# EAGLE design femto-tia-mainboard (EAGLE 9.2.2)
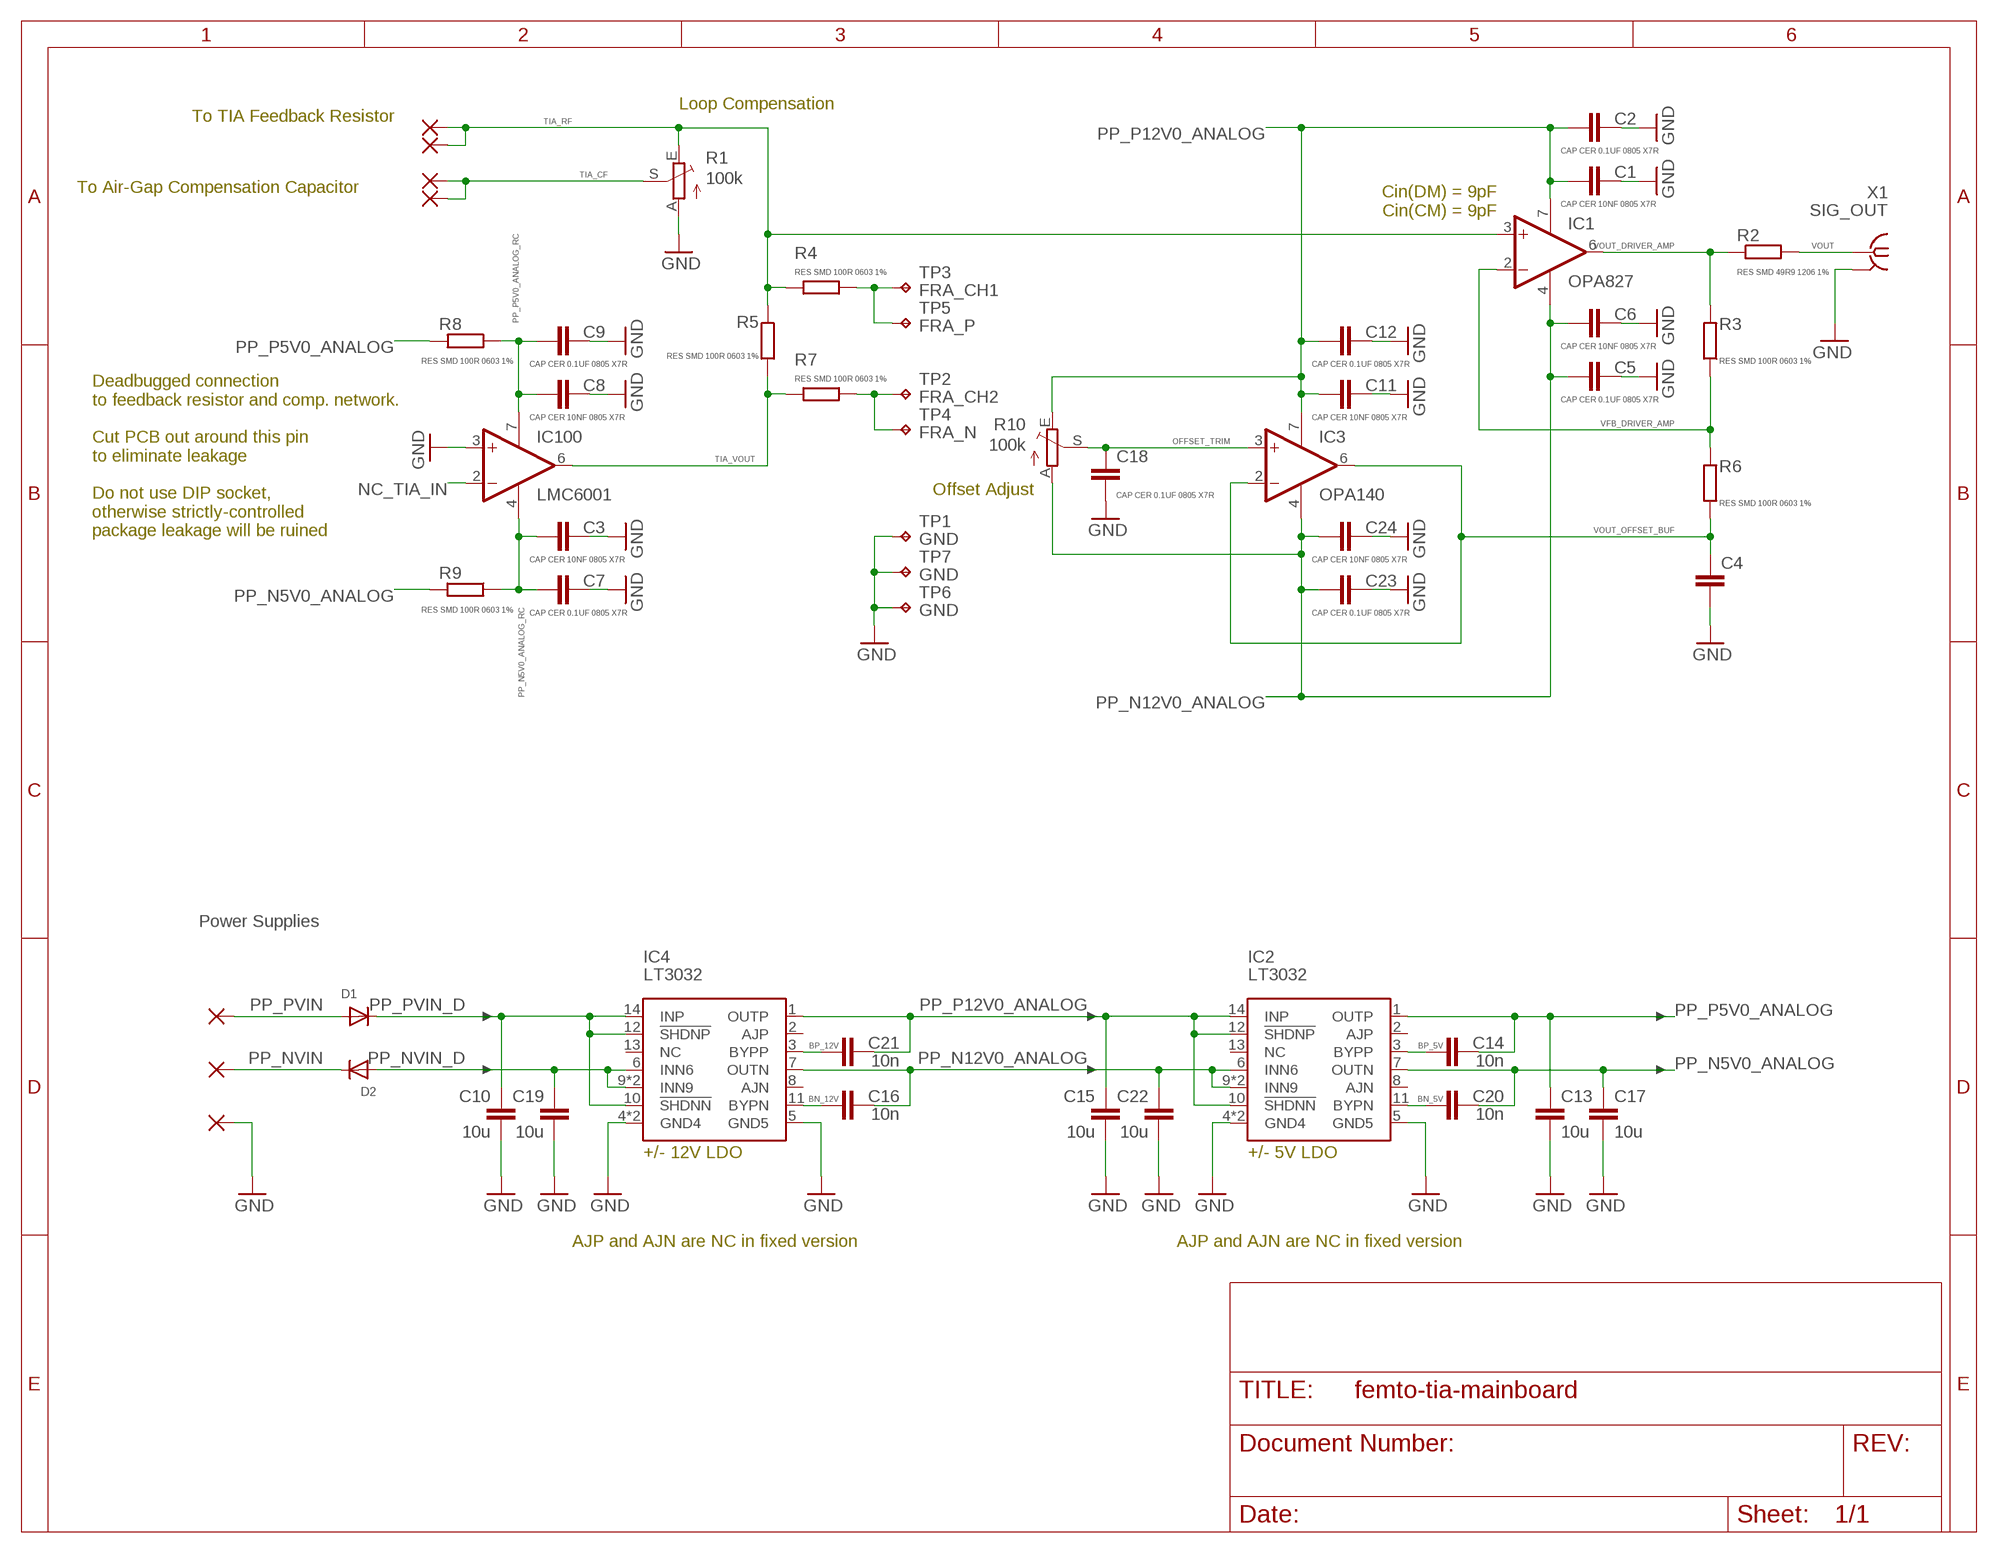
[diagram p0: schematic, sheet 1]

## Parts
C1  CAP CER 10NF 0805 X7R  C-EUC0805  [C0805]
C2  CAP CER 0.1UF 0805 X7R  C-EUC0805  [C0805]
C3  CAP CER 10NF 0805 X7R  C-EUC0805  [C0805]
C4  C-EUC0805  [C0805]
C5  CAP CER 0.1UF 0805 X7R  C-EUC0805  [C0805]
C6  CAP CER 10NF 0805 X7R  C-EUC0805  [C0805]
C7  CAP CER 0.1UF 0805 X7R  C-EUC0805  [C0805]
C8  CAP CER 10NF 0805 X7R  C-EUC0805  [C0805]
C9  CAP CER 0.1UF 0805 X7R  C-EUC0805  [C0805]
C10  10u  C-EUC1206  [C1206]
C11  CAP CER 10NF 0805 X7R  C-EUC0805  [C0805]
C12  CAP CER 0.1UF 0805 X7R  C-EUC0805  [C0805]
C13  10u  C-EUC1206  [C1206]
C14  10n  C-EUC0603  [C0603]
C15  10u  C-EUC1206  [C1206]
C16  10n  C-EUC0603  [C0603]
C17  10u  C-EUC1206  [C1206]
C18  CAP CER 0.1UF 0805 X7R  C-EUC0805  [C0805]
C19  10u  C-EUC1206  [C1206]
C20  10n  C-EUC0603  [C0603]
C21  10n  C-EUC0603  [C0603]
C22  10u  C-EUC1206  [C1206]
C23  CAP CER 0.1UF 0805 X7R  C-EUC0805  [C0805]
C24  CAP CER 10NF 0805 X7R  C-EUC0805  [C0805]
D1  DIODESMA  [SMADIODE]
D2  DIODESMA  [SMADIODE]
IC1  OPA827  [SO08]
IC2  LT3032  [DFN14-4X3DE]
IC3  OPA140  OPA827  [SO08]
IC4  LT3032  [DFN14-4X3DE]
IC100  LMC6001  [DIL08]
R1  100k  TRIM_EU-RJ9W  [RJ9W]
R2  RES SMD 49R9 1206 1%  R-EU_R1206  [R1206]
R3  RES SMD 100R 0603 1%  R-EU_R0805  [R0805]
R4  RES SMD 100R 0603 1%  R-EU_R0805  [R0805]
R5  RES SMD 100R 0603 1%  R-EU_R0805  [R0805]
R6  RES SMD 100R 0603 1%  R-EU_R0805  [R0805]
R7  RES SMD 100R 0603 1%  R-EU_R0805  [R0805]
R8  RES SMD 100R 0603 1%  R-EU_R0805  [R0805]
R9  RES SMD 100R 0603 1%  R-EU_R0805  [R0805]
R10  100k  TRIM_EU-RJ9W  [RJ9W]
TP1  GND  KEYSTONE_5000  [KEYSTONE_5000_MINIATURE]
TP2  FRA_CH2  KEYSTONE_5000  [KEYSTONE_5000_MINIATURE]
TP3  FRA_CH1  KEYSTONE_5000  [KEYSTONE_5000_MINIATURE]
TP4  FRA_N  KEYSTONE_5000  [KEYSTONE_5000_MINIATURE]
TP5  FRA_P  KEYSTONE_5000  [KEYSTONE_5000_MINIATURE]
TP6  GND  KEYSTONE_5000  [KEYSTONE_5000_MINIATURE]
TP7  GND  KEYSTONE_5000  [KEYSTONE_5000_MINIATURE]
U$1  VIA  [VIA]
U$2  VIA  [VIA]
U$3  VIA  [VIA]
U$4  RF  VIA  [VIA]
U$5  GND  VIA  [VIA]
U$6  IN+  VIA  [VIA]
U$7  IN-  VIA  [VIA]
X1  SIG_OUT  SMA-142-0701-881/886  [J502-ND-142-0701-881/886]

## Nets
BN_5V: C20.1 IC2.11(BYPN)
BN_12V: C16.1 IC4.11(BYPN)
BP_5V: C14.1 IC2.3(BYPP)
BP_12V: C21.1 IC4.3(BYPP)
GND: C1.2 C2.2 C3.2 C4.2 C5.2 C6.2 C7.2 C8.2 C9.2 C10.2 C11.2 C12.2 C13.2 C15.2 C17.2 C18.2 C19.2 C22.2 C23.2 C24.2 IC2.4(GND4) IC2.4_PAD(GND4) IC4.4(GND4) IC4.4_PAD(GND4) IC100.3(+IN) R1.A TP1.P$1 TP6.P$1 TP7.P$1 U$5.1(P) X1.G@1(GND)
N$1: IC4.5(GND5) ; supply symbol labelled GND
N$2: IC2.5(GND5) ; supply symbol labelled GND
N$3: R7.2 TP2.P$1 TP4.P$1
N$4: R4.2 TP3.P$1 TP5.P$1
NC_TIA_IN: IC100.2(-IN)
OFFSET_TRIM: C18.1 IC3.3(+IN) R10.S
PP_N5V0_ANALOG: C17.1 C20.2 IC2.7(OUTN) R9.2
PP_N5V0_ANALOG_RC: C3.1 C7.1 IC100.4(V-) R9.1
PP_N12V0_ANALOG: C5.1 C6.1 C16.2 C22.1 C23.1 C24.1 IC1.4(V-) IC2.6(INN6) IC2.9(INN9) IC2.9_PAD(INN9) IC3.4(V-) IC4.7(OUTN) R10.A
PP_NVIN: D2.C U$7.1(P)
PP_NVIN_D: C19.1 D2.A IC4.6(INN6) IC4.9(INN9) IC4.9_PAD(INN9)
PP_P5V0_ANALOG: C13.1 C14.2 IC2.1(OUTP) R8.2
PP_P5V0_ANALOG_RC: C8.1 C9.1 IC100.7(V+) R8.1
PP_P12V0_ANALOG: C1.1 C2.1 C11.1 C12.1 C15.1 C21.2 IC1.7(V+) IC2.10(!SHDNN) IC2.12(!SHDNP) IC2.14(INP) IC3.7(V+) IC4.1(OUTP) R10.E
PP_PVIN: D1.A U$6.1(P)
PP_PVIN_D: C10.1 D1.C IC4.10(!SHDNN) IC4.12(!SHDNP) IC4.14(INP)
TIA_CF: R1.S U$1.1(P) U$2.1(P)
TIA_RF: IC1.3(+IN) R1.E R4.1 R5.1 U$3.1(P) U$4.1(P)
TIA_VOUT: IC100.6(OUT) R5.2 R7.1
VFB_DRIVER_AMP: IC1.2(-IN) R3.1 R6.2
VOUT: R2.2 X1.1
VOUT_DRIVER_AMP: IC1.6(OUT) R2.1 R3.2
VOUT_OFFSET_BUF: C4.1 IC3.2(-IN) IC3.6(OUT) R6.1
Unconnected: IC2.2(AJP) IC2.8(AJN) IC2.13(NC) IC4.2(AJP) IC4.8(AJN) IC4.13(NC)

## Notes on the sheet
- To TIA Feedback Resistor | Loop Compensation
- To Air-Gap Compensation Capacitor
- Cin(DM) = 9pF
  Cin(CM) = 9pF
- Offset Adjust
- Deadbugged connection
  to feedback resistor and comp. network.
  
  Cut PCB out around this pin
  to eliminate leakage
  
  Do not use DIP socket,
  otherwise strictly-controlled
  package leakage will be ruined
- Power Supplies
- +/- 12V LDO | +/- 5V LDO
- AJP and AJN are NC in fixed version | AJP and AJN are NC in fixed version

## Power pins joined to a net without a drawn wire
GND: X1.G@2(GND) X1.G@3(GND) X1.G@4(GND)

## Library data of the parts
C1-C9 C11 C12 C18 C23 C24 = rcl-modified-footprints:C-EU: CAPACITOR, European symbol
C10 C13-C17 C19-C22 = rcl:C-EU: CAPACITOR, European symbol
D1 D2 = adafruit:DIODE: Diode SMADIODE - SMA Surface Mount Package 20V 1A Schottky Diode Digikey: 641-1014-6-ND DO-1N4148 - Through Hole Small Current Diode SOD-123 20V 1 A (.5mV Vf) Schottky Diode - Digikey: MBRX120TPMSCT-ND SOD-323 10V 570mA (.38mV Vf, 3ns) Schottky Diode - Digikey: ZLLS410CT-ND SOD-523 30V 30mA Schottky Diode (RB751S-40TE61) - Digikey: RB751S-40TE61CT-ND SOT23-R/W - SOT23 Package (R = Solder Paste/Reflow Ovens, W = Hand-Soldering) BAT54Film 40V 300mA - Digikey: 497-7162-1-ND
IC1 = femto-tia:OPA827
IC2 IC4 = meng:LT3032: LT3032 dual postive/negative LDO linear regulator
IC3 = femto-tia:OPA827; VALUE: OPA827
IC100 = femto-tia:LMC6001
R1 R10 = pot:TRIM_EU-: POTENTIOMETER
R2-R9 = rcl-modified-footprints:R-EU_: RESISTOR, European symbol
TP1-TP7 = Kramnik's Library:KEYSTONE_5000
U$1-U$7 = 4534:VIA: Pad to connect top and bottom PCB layers
X1 = meng:SMA-: SMA 50 Ohm End Launch Jack Receptacle - Round Contact Johnson Components Source: www.johnsoncomponents.com .. J502-ND.pdf; MF: JOHNSON COMPONENTS; MPN: 142-0701-881; OC_FARNELL: 1608603; OC_NEWARK: 08B906

## Board
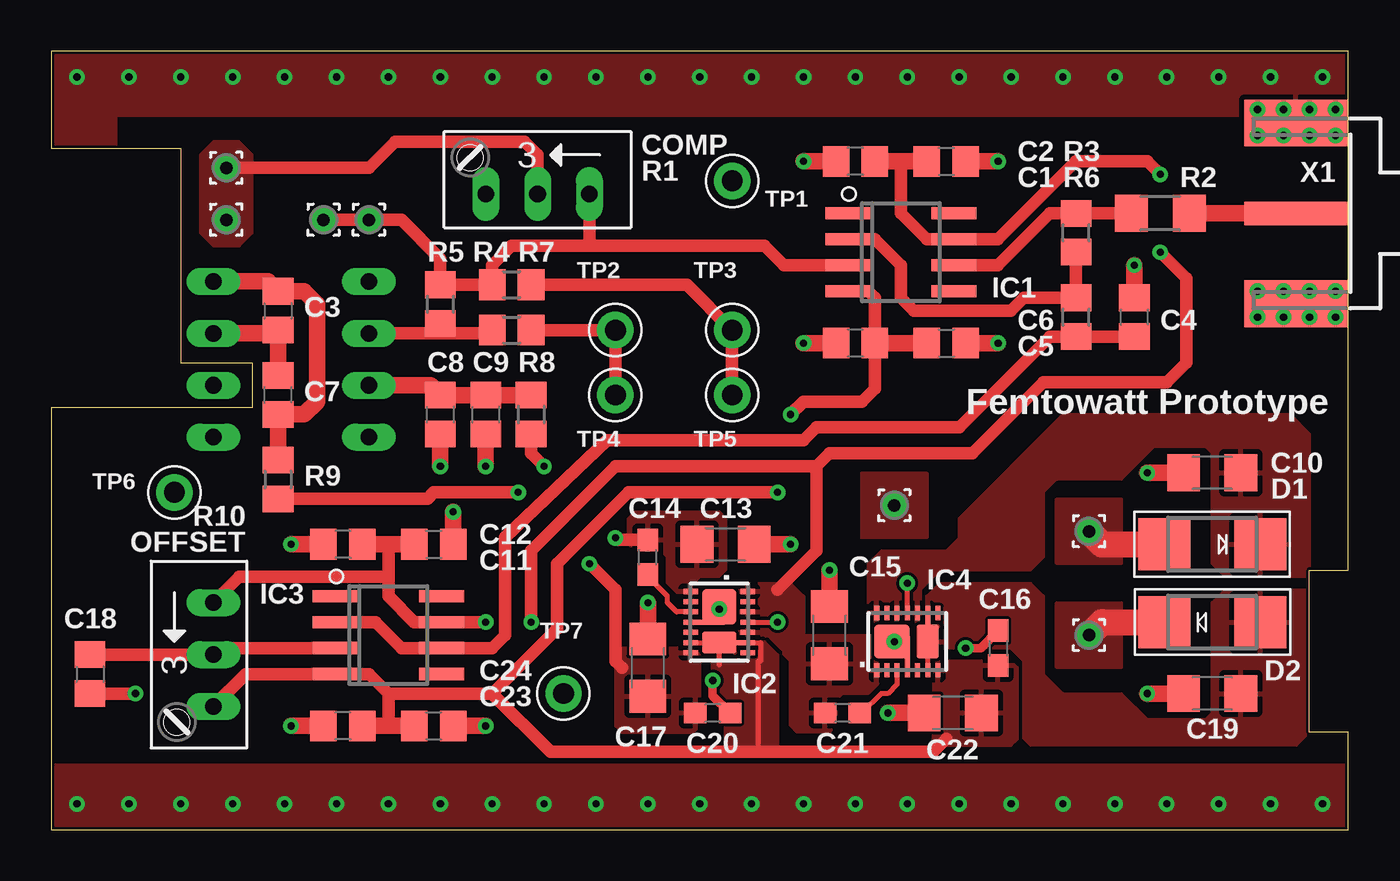
[diagram p1: board, top side]
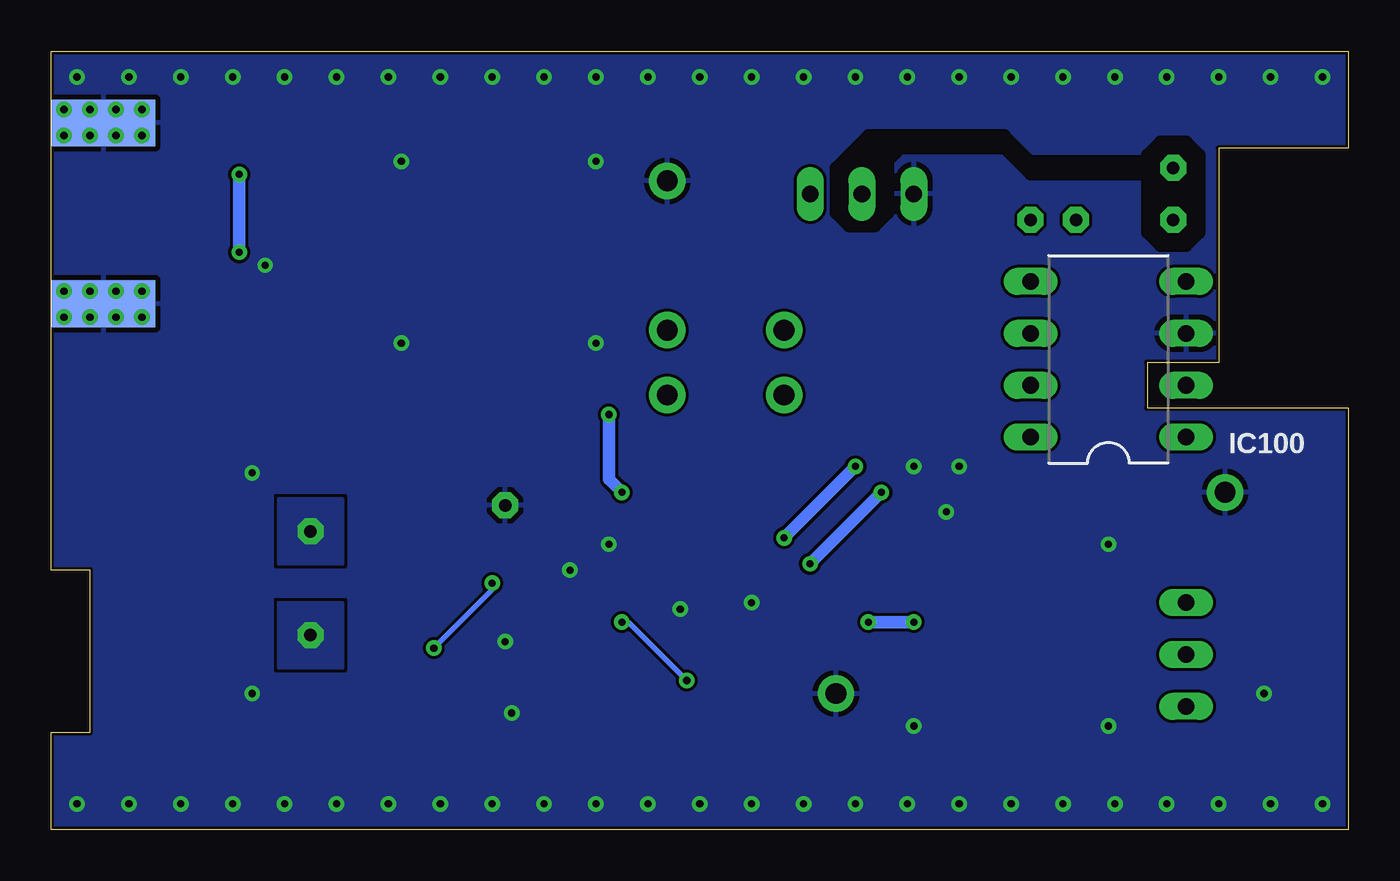
[diagram p2: board, bottom side, seen from below]

Size 63.5 x 38.1 mm. Coordinates in mm from the lower left corner, seen from the top.
Outline: 0,0 63.5,0 63.5,4.76 61.59,4.76 61.59,12.7 63.5,12.7 63.5,38.1 0,38.1 0,33.34 6.35,33.34 6.35,22.86 9.84,22.86 9.84,20.64 0,20.64 0,0
Copper layers (1*16): Top 0.035mm / dielectric 1.5mm / Bottom 0.035mm
Design rules "default *": minimum track width 6mil, minimum drill 0.35mm, track to track 6mil, track to pad 6mil, pad to pad 6mil, via to via 6mil, smd to smd 6mil, copper to edge 6mil, drill to drill 6mil, minimum pad ring 10mil, minimum via ring 8mil, stop-mask expansion 4mil, vias tented up to drill 0mil, thermal gap 10mil
bRestrict: area 7.3,28.6 to 25.1,34

### Footprints (pad centres in the part's own frame; a part is rotated, then mirrored left to right if it is on the bottom)
C0805 = smd 1.3 x 1.5: 1 -0.95,0; 2 0.95,0
C1206 = smd 1.6 x 1.8: 1 -1.4,0; 2 1.4,0
C0603 = smd 1.1 x 1: 1 -0.85,0; 2 0.85,0
SMADIODE = smd 2.54 x 2.54: A 2.349,0; C -2.349,0
SO08 = smd 0.6 x 2.2: 1 -1.905,-2.6; 2 -0.635,-2.6; 3 0.635,-2.6; 4 1.905,-2.6; 5 1.905,2.6; 6 0.635,2.6; 7 -0.635,2.6; 8 -1.905,2.6
DFN14-4X3DE = smd 0.25 x 0.7: 1 -1.5,-1.4; 2 -1,-1.4; 3 -0.5,-1.4; 5 0.5,-1.4; 6 1,-1.4; 7 1.5,-1.4; 8 1.5,1.4; 10 0.5,1.4; 11 0,1.4; 12 -0.5,1.4; 13 -1,1.4; 14 -1.5,1.4 | smd 0.25 x 2: 4 0,-0.75; 9 1,0.75 | smd 1.75 x 1.65: 4_PAD -0.75,0 | smd 1.07 x 1.65: 9_PAD 1,0
DIL08 = drill 0.813 long: 1 -3.81,-3.81; 2 -1.27,-3.81; 3 1.27,-3.81; 4 3.81,-3.81; 5 3.81,3.81; 6 1.27,3.81; 7 -1.27,3.81; 8 -3.81,3.81
RJ9W = drill 0.813 long: A 2.54,0.635; E -2.54,0.635; S 0,0.635
R1206 = smd 1.6 x 1.803: 1 -1.422,0; 2 1.422,0
R0805 = smd 1.3 x 1.5: 1 -0.95,0; 2 0.95,0
KEYSTONE_5000_MINIATURE = drill 1.016 pad 1.778: P$1 0,0
VIA = drill 0.61 pad 1.27 octagon: 1 0,0
J502-ND-142-0701-881/886 = smd 5.08 x 1.143: 1 2.565,0 | smd 5.08 x 2.286: G@1 2.565,4.42; G@2 2.565,-4.42 | smd 5.08 x 2.286 bottom: G@3 2.565,4.42; G@4 2.565,-4.42

### Placement (x,y rotation side)
C1  39.37,32.7 180 top
C2  43.81,32.7 0 top
C3  11.11,25.4 270 top
C4  53.02,25.08 90 top
C5  39.37,23.81 180 top
C6  43.81,23.81 0 top
C7  11.11,21.27 90 top
C8  19.05,20.32 270 top
C9  21.27,20.32 270 top
C10  56.83,17.46 180 top
C11  14.29,13.97 180 top
C12  18.73,13.97 0 top
C13  33.02,13.97 0 top
C14  29.21,13.34 90 top
C15  38.1,9.53 90 top
C16  46.35,8.89 270 top
C17  29.21,7.94 90 top
C18  1.91,7.62 270 top
C19  56.83,6.67 180 top
C20  32.38,5.71 180 top
C21  38.73,5.71 180 top
C22  44.13,5.71 180 top
C23  14.29,5.08 180 top
C24  18.73,5.08 0 top
D1  56.83,13.97 180 top
D2  56.83,10.16 0 top
IC1  41.59,28.26 270 top
IC2  32.7,10.16 270 top
IC3  16.51,9.53 270 top
IC4  41.91,9.21 0 top
IC100  11.75,23.02 90 bottom
R1  23.81,31.75 180 top
R2  54.29,30.16 0 top
R3  50.16,29.21 90 top
R4  22.54,26.67 0 top
R5  19.05,25.72 270 top
R6  50.16,25.08 90 top
R7  22.54,24.45 0 top
R8  23.5,20.32 270 top
R9  11.11,17.14 270 top
R10  7.3,8.57 270 top
TP1  33.34,31.75 0 top
TP2  27.62,24.45 0 top
TP3  33.34,24.45 0 top
TP4  27.62,21.27 0 top
TP5  33.34,21.27 0 top
TP6  6.03,16.51 0 top
TP7  25.08,6.67 0 top
U$1  8.57,32.38 0 top
U$2  8.57,29.84 0 top
U$3  13.34,29.84 0 top
U$4  15.56,29.84 0 top
U$5  41.27,15.88 0 top
U$6  50.8,14.61 0 top
U$7  50.8,9.53 0 top
X1  63.5,30.16 180 top

### Tracks (layer width: path | path; a pad name or v marks a point on that pad's centre or on a via)
BN_5V  (via drill 0.35)
  Top 0.254: IC2.11 v35.56,10.16
  Top 0.406: v32.38,7.3 32.38,6.57 C20.1
  Bottom 0.254: v35.56,10.16 35.24,10.16 v32.38,7.3
BN_12V  (via drill 0.35)
  Top 0.254: IC4.11 v41.91,12.06
  Top 0.406: C16.1 45.51,8.89 v44.77,8.89
  Bottom 0.254: v41.91,12.06 41.91,11.75 v44.77,8.89
BP_5V
  Top 0.254: C14.1 29.21,12.38 30.16,11.43 30.16,11.11 30.61,10.66 IC2.3
BP_12V
  Top 0.254: IC4.3 41.41,7.12 40.96,6.67 40.64,6.67 39.69,5.71 C21.1
GND  (via drill 0.35)
  Top 0.254: IC4.4 41.27,9.09 v41.27,9.21 IC4.4_PAD | v32.7,10.79 IC2.4_PAD IC2.4 | X1.G@4 60.33,35.19 v60.33,35.24 | X1.G@4 60.27,35.24 v59.05,35.24 | X1.G@4 v60.33,33.97 | X1.G@4 59.66,34.58 v59.05,33.97 | X1.G@4 60.98,34.58 v61.59,33.97 | X1.G@4 v61.59,35.24 | X1.G@4 62.2,34.58 v62.87,35.24 | X1.G@4 62.26,34.58 v62.87,33.97 | X1.G@1 60.98,25.74 v61.59,26.35 | X1.G@1 v61.59,25.08 | X1.G@1 62.2,25.74 v62.87,25.08 | X1.G@1 62.26,25.74 v62.87,26.35 | X1.G@1 59.66,25.74 v59.05,26.35 | X1.G@1 59.72,25.74 v59.05,25.08 | X1.G@1 v60.33,26.35 | X1.G@1 60.94,25.69 v60.33,25.08
  Top 0.61: v4.13,6.67 C18.2
  Top 0.813: v11.75,5.08 C23.2 | v11.75,13.97 C11.2 | C12.2 v19.68,15.56 | C24.2 v21.27,5.08 | v29.21,11.11 C17.2 | v40.96,5.71 C22.2 | C13.2 v36.2,13.97 | C15.2 v38.1,12.7 | IC100.3 10.95,24.29 C3.2 C7.2 | C8.2 v19.05,17.78 | C9.2 v21.27,17.78 | v53.66,17.46 C10.2 | v53.66,6.67 C19.2 | v36.83,32.7 C1.2 | C2.2 v46.35,32.7 | v36.83,23.81 C5.2 | C6.2 v46.35,23.81 | C4.2 v53.02,27.62
  Bottom 0.254: X1.G@1 60.33,25.74 v60.33,26.35
  other vias: 1.27,36.83 3.81,36.83 6.35,36.83 8.89,36.83 11.43,36.83 13.97,36.83 16.51,36.83 19.05,36.83 21.59,36.83 24.13,36.83 26.67,36.83 29.21,36.83 31.75,36.83 34.29,36.83 36.83,36.83 39.37,36.83 41.91,36.83 44.45,36.83 46.99,36.83 49.53,36.83 52.07,36.83 54.61,36.83 57.15,36.83 59.69,36.83 62.23,36.83 1.27,1.27 3.81,1.27 6.35,1.27 8.89,1.27 11.43,1.27 13.97,1.27 16.51,1.27 19.05,1.27 21.59,1.27 24.13,1.27 26.67,1.27 29.21,1.27 31.75,1.27 34.29,1.27 36.83,1.27 39.37,1.27 41.91,1.27 44.45,1.27 46.99,1.27 49.53,1.27 52.07,1.27 54.61,1.27 57.15,1.27 59.69,1.27 62.23,1.27
  pour Bottom (rank 4): 0,0 0,38.1 63.5,38.1 63.5,0
  pour Top: 0,0 0,3.17 63.5,3.17 63.5,0
  pour Top: 0,38.1 63.5,38.1 63.5,34.92 3.17,34.92 3.17,33.02 0,33.02
  pour Top (no thermals): 39.69,17.46 42.86,17.46 42.86,14.29 39.69,14.29
N$3
  Top 0.61: R7.2 TP2.P$1 TP4.P$1
N$4
  Top 0.61: TP5.P$1 TP3.P$1 31.11,26.67 R4.2
OFFSET_TRIM
  Top 0.61: IC3.3 8.26,8.89 R10.S C18.1
PP_N5V0_ANALOG  (via drill 0.35)
  Top 0.61: R9.2 18.42,16.2 18.73,16.51 v22.86,16.51 | v26.35,13.02 27.62,11.75 27.62,8.26 27.94,7.94
  Bottom 0.61: v22.86,16.51 v26.35,13.02
  pour Top: 27.62,8.57 27.62,5.08 27.92,4.78 31.43,4.76 31.75,5.08 31.75,8.57 31.43,8.89 27.96,8.91
PP_N5V0_ANALOG_RC
  Top 0.254: 11.11,18.41 R9.1
  Top 0.813: IC100.4 10.63,26.83 C3.1 12.38,26.35 13.02,25.72 13.02,20.95 12.38,20.32 C7.1 11.11,18.41
PP_N12V0_ANALOG  (via drill 0.35)
  Top 0.254: IC2.9 IC2.9_PAD | IC2.9_PAD IC2.6 34.73,9.16 34.73,8.26 34.61,8.26 34.61,3.81 | IC2.9_PAD 32.7,8.06
  Top 0.61: R10.A 9.53,7.62 IC3.4 15.56,7.62 16.51,6.67 | IC1.4 40.01,26.35 40.32,26.04 C5.1 40.32,21.59 39.69,20.95 36.83,20.95 v36.2,20.32 | 43.81,4.45 43.18,3.81 34.61,3.81 24.45,3.81 21.59,6.67 | 16.51,6.67 16.51,5.08 | 21.59,6.67 16.51,6.67 | 21.59,6.67 24.77,9.84 24.77,13.02 28.26,16.51 v35.56,16.51
  Top 0.813: C23.1 16.51,5.08 C24.1 | C5.1 C6.1
  Bottom 0.61: v36.2,20.32 36.2,17.14 v35.56,16.51
  pour Top: 43.5,4.13 46.99,4.13 47.29,4.42 47.31,7.94 46.99,8.26 43.18,8.26 43.16,4.47
  pour Top (rank 2): 32.38,6.67 32.38,9.21 34.92,9.21 35.56,8.57 35.56,3.81 33.02,3.81 33.02,6.03
PP_NVIN
  Top 1.27: U$7.1 51.44,10.16 D2.C
  pour Top (no thermals): 49.21,11.11 52.39,11.11 52.39,7.94 49.21,7.94
  pour Bottom (no thermals): 49.21,11.11 52.39,11.11 52.39,7.94 49.21,7.94
PP_NVIN_D
  Top 0.254: IC4.6 IC4.9_PAD
  pour Top (rank 2): 47.62,8.26 46.99,8.89 42.86,8.89 42.86,11.43 43.5,12.06 47.94,12.06 48.58,11.43 48.58,7.62 49.53,6.67 52.39,6.67 53.66,5.4 56.52,5.4 56.83,5.71 56.83,11.11 57.47,11.75 61.59,11.75 61.59,4.76 60.96,4.13 47.94,4.13 47.62,4.45
PP_P5V0_ANALOG  (via drill 0.35)
  Top 0.61: v27.62,14.29 27.73,14.19 C14.2 | R8.2 23.5,18.41 v24.13,17.78
  Bottom 0.61: v24.13,17.78 v27.62,14.29
  pour Top: 33.02,15.24 33.02,12.7 32.7,12.38 31.75,12.38 31.43,12.06 31.43,11.43 30.8,11.43 30.16,12.06 30.16,13.34 29.84,13.65 28.57,13.65 28.26,13.97 28.26,15.24 28.57,15.56 32.68,15.58
PP_P5V0_ANALOG_RC
  Top 0.813: IC100.7 18.57,21.75 C8.1 C9.1 R8.1
PP_P12V0_ANALOG  (via drill 0.35)
  Top 0.61: 16.51,12.38 16.51,11.43 17.78,10.16 IC3.7 v21.27,10.16 | 16.51,12.38 16.51,13.97 | R10.E 9.21,12.38 16.51,12.38 | 41.59,32.7 41.59,30.16 42.86,28.89 IC1.7 46.35,28.89 50.16,32.7 53.66,32.7 v54.29,32.07 | v54.29,28.26 55.56,26.99 55.56,22.86 54.61,21.91 48.58,21.91 45.09,18.41 38.1,18.41 37.47,17.78 | 37.47,17.78 37.47,13.65 35.56,11.75 | v23.5,10.16 23.5,13.65 27.62,17.78 37.47,17.78
  Top 0.813: C11.1 16.51,13.97 C12.1 | C1.1 41.59,32.7 C2.1
  Bottom 0.61: v54.29,32.07 v54.29,28.26 | v21.27,10.16 v23.5,10.16
  pour Top: 36.2,9.53 40.32,9.53 40.64,9.21 40.64,7.3 40.01,6.67 38.73,6.67 38.42,6.35 38.42,5.08 38.1,4.76 36.51,4.76 36.2,5.08
  pour Top (rank 3): 33.66,12.06 36.2,12.06 36.83,11.43 36.83,7.62 34.92,9.53 33.66,9.53
PP_PVIN
  Top 1.27: U$6.1 51.44,13.97 D1.A
  pour Bottom (no thermals): 49.21,16.19 52.39,16.19 52.39,13.02 49.21,13.02
  pour Top (no thermals): 49.21,16.19 52.39,16.19 52.39,13.02 49.21,13.02
PP_PVIN_D
  pour Top (rank 3): 57.47,12.38 56.83,13.02 56.83,18.41 56.52,18.73 53.98,18.73 52.39,17.14 49.21,17.14 48.58,16.51 48.58,13.34 47.94,12.7 43.5,12.7 42.55,11.75 42.55,10.16 40.01,10.16 40.01,13.02 40.64,13.65 43.81,13.65 44.45,14.29 44.45,15.24 49.53,20.32 60.64,20.32 61.59,19.37 61.59,12.38
TIA_CF
  Top 0.61: U$1.1 15.56,32.38 16.83,33.66 23.18,33.66 23.81,33.02 R1.S
  pour Top (no thermals): 7.3,29.21 7.94,28.57 9.21,28.57 9.84,29.21 9.84,33.02 9.21,33.66 7.94,33.66 7.3,33.02
TIA_RF
  Top 0.61: IC1.3 35.88,27.62 34.92,28.57 26.35,28.57 | R4.1 R5.1 19.05,27.94 17.14,29.84 U$4.1 U$3.1 | R4.1 | R4.1 21.59,27.62 22.54,28.57 26.35,28.57 | R1.E 26.35,28.57
TIA_VOUT
  Top 0.61: IC100.6 19.05,24.29 | 19.05,24.29 21.43,24.29 R7.1 | R5.2 19.05,24.29
VFB_DRIVER_AMP
  Top 0.61: IC1.2 40.32,28.89 41.59,27.62 41.59,26.04 42.23,25.4 46.99,25.4 47.62,26.03 R6.2 R3.1
VOUT
  Top 0.813: X1.1 R2.2
VOUT_DRIVER_AMP
  Top 0.61: IC1.6 46.35,27.62 48.9,30.16 R3.2 | R3.2 R2.1 | R3.2
VOUT_OFFSET_BUF
  Top 0.61: IC3.2 15.88,10.16 17.14,8.89 IC3.6 21.59,8.89 22.23,9.53 22.23,14.3 27.21,19.05 36.83,19.05 37.47,19.68 44.45,19.68 48.9,24.13 R6.1 C4.1

### Text on the board
tPlace: COMP | Femtowatt Prototype | OFFSET